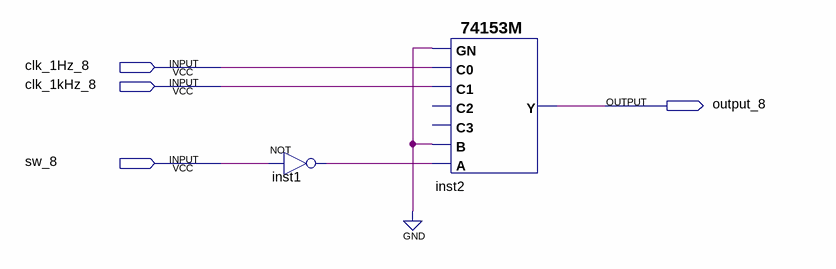
[diagram p0: schematic sheet]
// Quartus schematic spead_select_8.bdf as structural Verilog: 2 symbols, 4 pins
module spead_select_8 (
  input  clk_1Hz_8,
  input  clk_1kHz_8,
  input  sw_8,
  output output_8
);

  wire inst1_out;

  not inst1 (inst1_out, sw_8);
  \74153M  inst2 (.A(inst1_out), .B(1'b0), .C1(clk_1kHz_8), .C0(clk_1Hz_8), .GN(1'b0), .Y(output_8));  // open: C3, C2
endmodule
